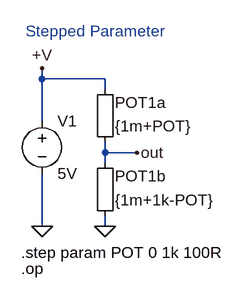
[diagram p0: schematic potentiometer demo1.asc]
potentiometer demo1.asc, the LTspice schematic file:
Version 4
SHEET 1 880 680
WIRE -416 192 -416 176
WIRE -320 192 -416 192
WIRE -320 208 -320 192
WIRE -416 256 -416 192
WIRE -320 304 -320 288
WIRE -272 304 -320 304
WIRE -320 320 -320 304
WIRE -416 416 -416 336
WIRE -320 416 -320 400
FLAG -416 416 0
FLAG -416 176 +V
FLAG -320 416 0
FLAG -272 304 out
SYMBOL voltage -416 240 R0
WINDOW 123 0 0 Left 0
WINDOW 39 0 0 Left 0
SYMATTR InstName V1
SYMATTR Value 5V
SYMBOL Misc\\EuropeanResistor -336 304 M180
WINDOW 0 31 76 Left 2
WINDOW 3 31 40 Left 2
SYMATTR InstName POT1a
SYMATTR Value {1m+POT}
SYMBOL Misc\\EuropeanResistor -336 416 M180
WINDOW 0 31 76 Left 2
WINDOW 3 31 40 Left 2
SYMATTR InstName POT1b
SYMATTR Value {1m+1k-POT}
TEXT -448 456 Left 2 !.step param POT 0 1k 100R
TEXT -448 480 Left 2 !.op
TEXT -336 120 Center 2 ;Stepped Parameter

The netlist it stands for:
* potentiometer demo1.asc
V1 +V 0 5V
R§POT1a out +V {1m+POT}
R§POT1b 0 out {1m+1k-POT}
.step param POT 0 1k 100R
.op
* Stepped Parameter
.backanno
.end